# EAGLE design SubProgrammableBall (EAGLE 9.6.2)
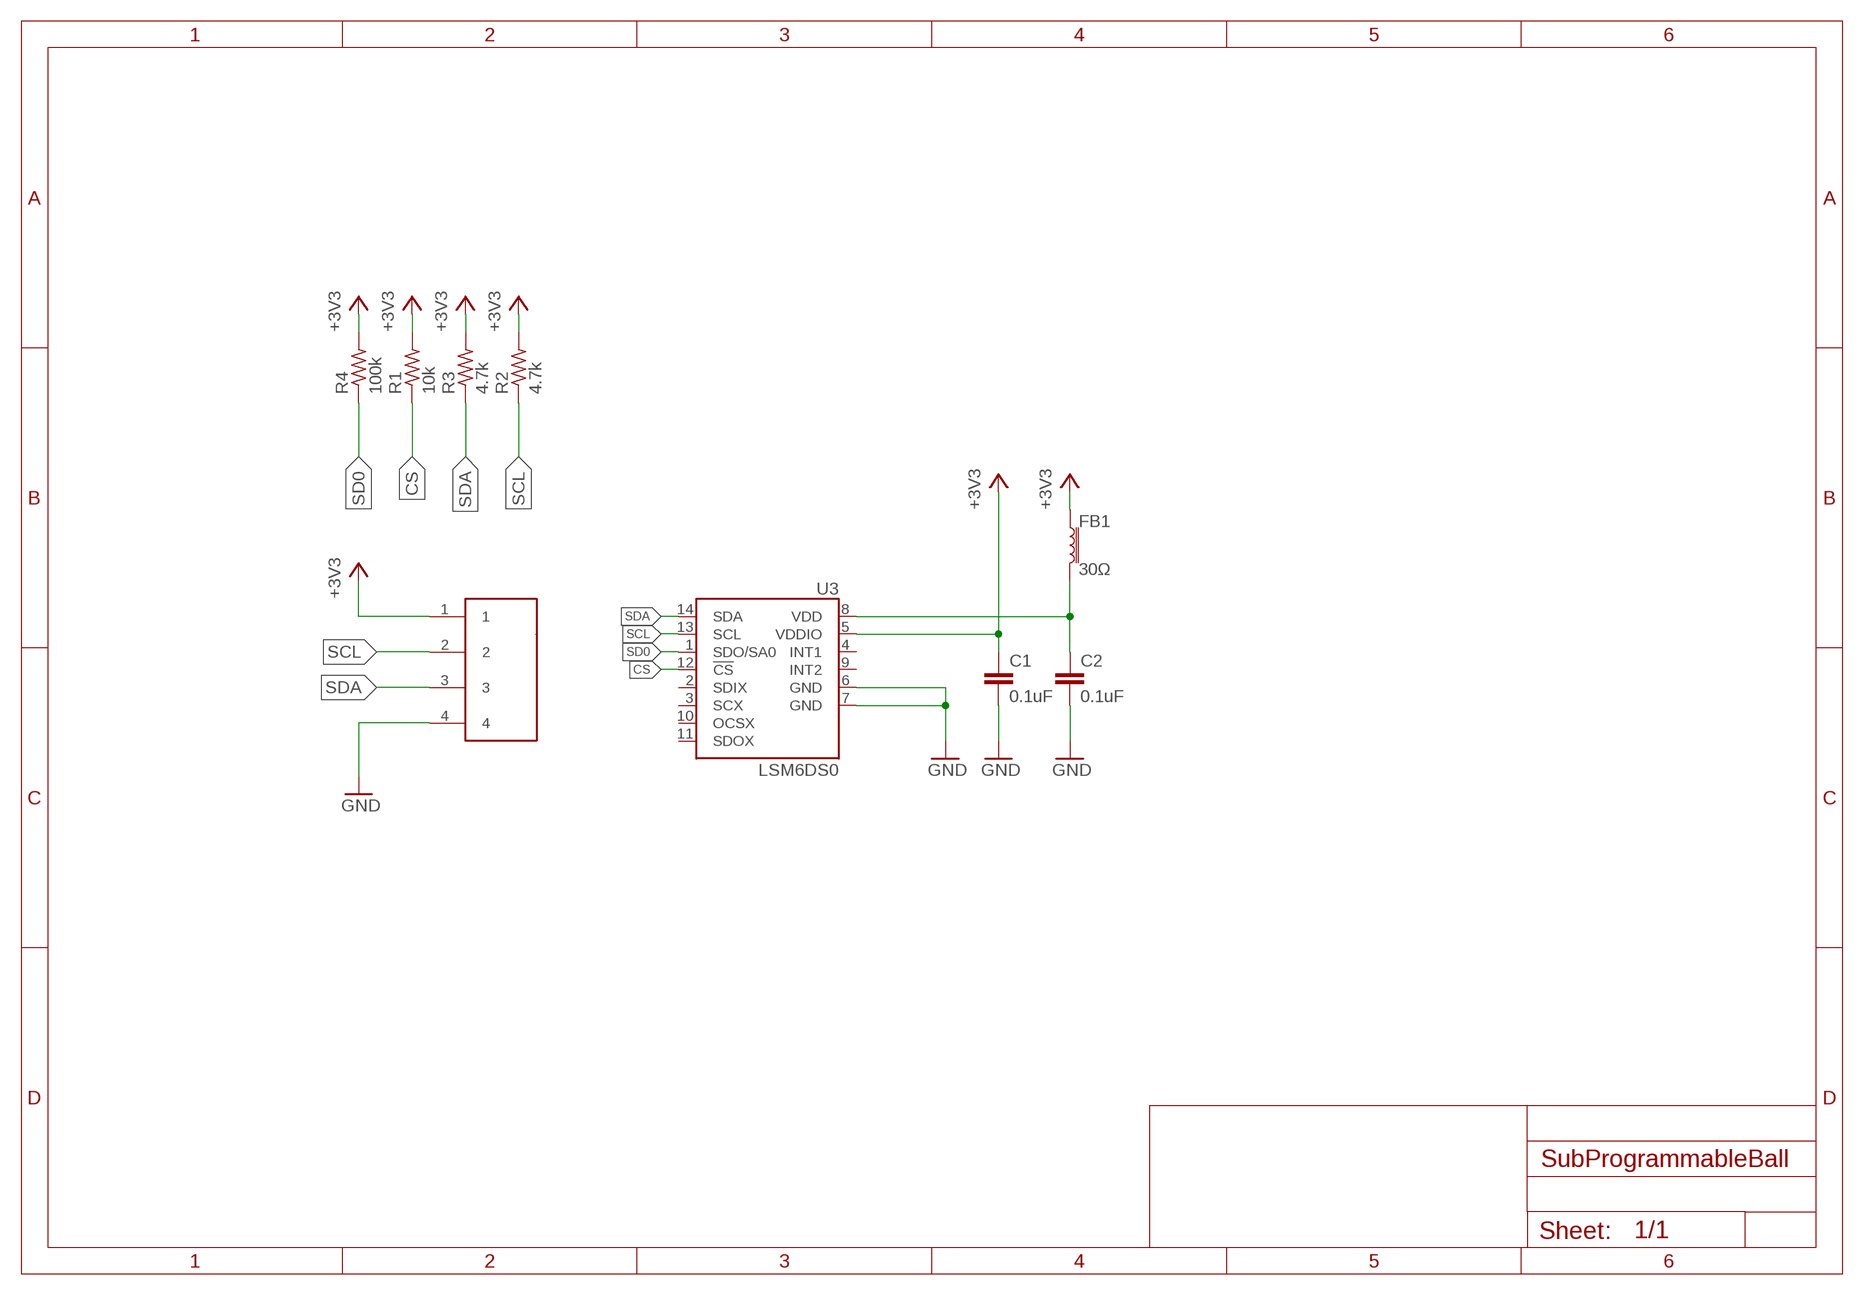
[diagram p0: schematic, sheet 1]

## Parts
C1  0.1uF  C-EUC0603  [C0603]
C2  0.1uF  C-EUC0603  [C0603]
CON1  B4B-ZR-SM4-TF  [CONN_B4B-ZR-SM4-TF]
FB1  30Ω  FERRITE_BEAD-0603-30Ω-100MHZ  [0603]
R1  10k  R-US_R0603  [R0603]
R2  4.7k  R-US_R0603  [R0603]
R3  4.7k  R-US_R0603  [R0603]
R4  100k  R-US_R0603  [R0603]
U3  LSM6DS0  [LGA14L]

## Nets
+3V3 [Power]: C1.1 CON1.1 FB1.1 R1.2 R2.2 R3.2 R4.2 U3.5(VDDIO)
CS: R1.1 U3.12(!CS!)
GND [GND]: C1.2 C2.2 CON1.4 U3.6(GND) U3.7(GND)
N$1: C2.1 FB1.2 U3.8(VDD)
SCL: CON1.2 R2.1 U3.13(SCL)
SD0: R4.1 U3.1(SDO/SA0)
SDA: CON1.3 R3.1 U3.14(SDA)
Unconnected: U3.2(SDIX) U3.3(SCX) U3.4(INT1) U3.9(INT2) U3.10(OCSX) U3.11(SDOX)

## Library data of the parts
C1 C2 = SubProgrammableBall:C-EU: CAPACITOR, European symbol; SPICEPREFIX: C
CON1 = SubProgrammableBall:B4B-ZR-SM4-TF
FB1 = SubProgrammableBall:FERRITE_BEAD: Ferrite Bead (blocks, cores, rings, chokes, etc.) Inductor with layers of ferrite used to suppress high frequencies. Often used to isolate high frequency noise. SparkFun Products: IOIO-OTG - V2.2 <https://www.sparkfun.com/products/13613> SparkFun SAMD21 Mini Breakout <https://www.sparkfun.com/products/13664> SparkFun 6 Degrees of Freedom Breakout - LSM6DS3 <https://www.sparkfun.com/products/13339> SparkFun SAMD21 Dev Breakout <https://www.sparkfun.com/products/13672> Lilypad MP3 <https://www.sparkfun.com/products/11013>; PROD_ID: NDUC-07859
R1-R4 = SubProgrammableBall:R-US_: RESISTOR, American symbol; SPICEPREFIX: R
U3 = temp:LSM6DS0; PROD_ID: IC-15837

## Net classes
1 Power: width 0.254 mm
2 GND: width 0.381 mm

## Board
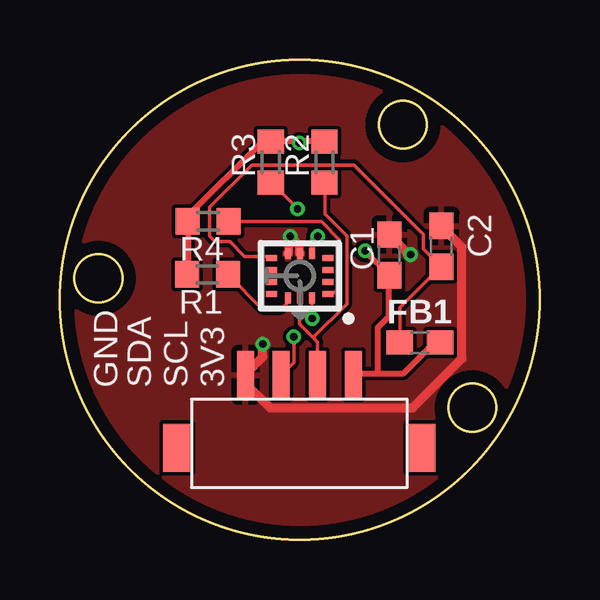
[diagram p1: board, top side]
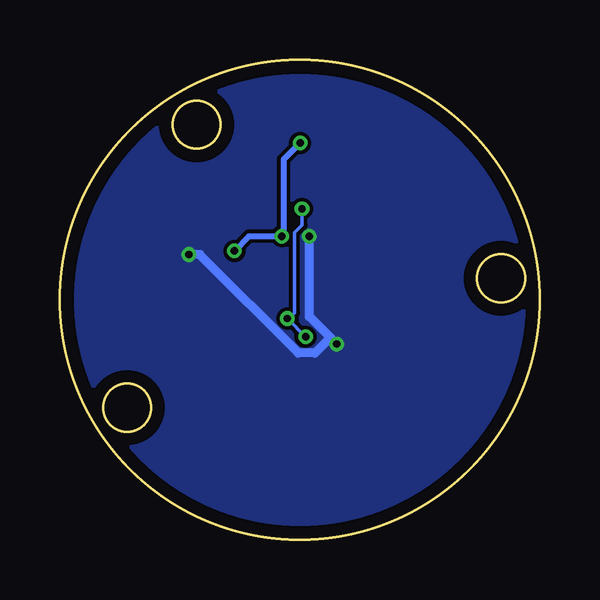
[diagram p2: board, bottom side, seen from below]

Size 20 x 20 mm. Coordinates in mm from the lower left corner, seen from the top.
Outline: circle at 10,10 radius 10
Outline: circle at 14.3,17.3 radius 1
Outline: circle at 17.2,5.5 radius 1
Outline: circle at 1.6,10.9 radius 1
Copper layers (1*16): Top 0.035mm / dielectric 1.6mm / Bottom 0.035mm
Design rules "Elecrow_2-layer_PCB_eagle_rule": minimum track width 6mil, minimum drill 12mil, track to track 6mil, track to pad 6mil, pad to pad 6mil, via to via 8mil, smd to smd 0mil, copper to edge 20mil, drill to drill 10mil, minimum pad ring 6mil, minimum via ring 6mil, stop-mask expansion 0mil, vias tented up to drill 100mil, thermal gap 10mil

### Footprints (pad centres in the part's own frame; a part is rotated, then mirrored left to right if it is on the bottom)
C0603 = smd 1.1 x 1: 1 -0.85,0; 2 0.85,0
CONN_B4B-ZR-SM4-TF = smd 0.711 x 1.981: 1 -2.261,-1.524; 2 -0.762,-1.524; 3 0.762,-1.524; 4 2.235,-1.524 | smd 1.194 x 2.007: 5 -5.08,1.524; 6 5.08,1.524
0603 = smd 1.1 x 1: 1 -0.85,0; 2 0.85,0
R0603 = smd 1 x 1.1: 1 -0.85,0; 2 0.85,0
LGA14L = smd 0.45 x 0.25: 1 -1.175,0.75; 2 -1.175,0.25; 3 -1.175,-0.25; 4 -1.175,-0.75; 8 1.175,-0.75; 9 1.175,-0.25; 10 1.175,0.25; 11 1.175,0.75 | smd 0.25 x 0.45: 5 -0.5,-0.925; 6 0,-0.925; 7 0.5,-0.925; 12 0.5,0.925; 13 0,0.925; 14 -0.5,0.925

### Placement (x,y rotation side)
C1  13.74,11.87 90 top
C2  15.91,12.23 90 top
CON1  9.98,5.34 180 top
FB1  15.01,8.22 180 top
R1  6.15,11.06 180 top
R2  11.03,15.74 90 top
R3  8.79,15.74 90 top
R4  6.18,13.27 180 top
U3  10,11 180 top

### Tracks (layer width: path | path; a pad name or v marks a point on that pad's centre or on a via)
+3V3  (via drill 0.3)
  Top 0.254: v10.74,12.65 10.52,12.42 10.52,11.96 U3.5 | v12.72,12.04 13.72,11.05 C1.1 13.72,10.9 13.72,9.3 13.26,8.84 13.26,6.93 | 13.26,6.93 12.27,6.93 CON1.1 | 13.26,6.93 14.33,6.93 15.54,8.15 15.85,8.15 FB1.1 | R1.2 5.33,11.12 R4.2 5.41,13.34 5.41,13.56 8.38,16.54 8.69,16.54 R3.2 8.84,16.61 9.98,16.61 | 9.98,16.61 10.97,16.61 R2.2 | v9.98,16.54 9.98,16.61
  Bottom 0.254: v12.72,12.04 12.12,12.65 v10.74,12.65 10.67,12.72 10.67,15.85 v9.98,16.54
CS
  Top 0.152: U3.12 9.45,10.06 9.45,9.83 9.22,9.6 8.46,9.6 7.01,11.05 R1.1
GND  (via drill 0.3)
  Top 0.381: 9.68,12.42 9.53,12.27 9.53,11.96 U3.7 | 9.68,12.42 9.83,12.42 9.98,12.27 9.98,11.96 U3.6 | v9.6,12.65 9.6,12.57 9.68,12.42 | v8.46,8.15 8.46,7.62 7.77,6.93 CON1.4 7.85,6.71 7.85,6.4 8.76,5.49 14.71,5.49 16.76,7.54 16.76,12.19 15.93,13.03 C2.2 | v14.63,11.89 14.55,11.89 13.79,12.65 C1.2
  Bottom 0.381: v9.6,12.65 9.6,9.3 8.72,8.42 | v8.46,8.15 8.72,8.42 | v14.63,11.89 14.17,11.89 10.06,7.77 9.37,7.77 8.72,8.42
  pour Top: 0,0 20,0 20,20 0,20
  pour Bottom: 0,20 20,20 20,0 0,0
N$1
  Top 0.152: U3.8 8.76,11.81 7.7,11.81 7.09,12.42 6.48,12.42 6.25,12.65 6.25,13.87 8,15.62 12.27,15.62 15.16,12.72 15.16,12.12 15.85,11.43 C2.1 15.85,11.35 14.17,9.68 14.17,8.23 FB1.2
SCL
  Top 0.152: 10.55,8.42 10.74,8.23 10.74,6.93 CON1.2 | 10.55,8.42 9.98,8.99 9.98,10.06 U3.13 | 10.55,8.42 11.96,9.83 11.96,12.65 11.05,13.56 11.05,14.86 R2.1
SD0
  Top 0.152: U3.1 11.2,10.29 11.43,10.29 11.66,10.52 11.66,12.5 10.9,13.26 7.09,13.26 R4.1
SDA  (via drill 0.3)
  Top 0.152: v10.52,9.22 10.52,10.06 U3.14 | v9.75,8.46 9.75,7.39 9.3,6.93 CON1.3 | v9.91,13.79 8.84,14.86 R3.1
  Bottom 0.152: v9.75,8.46 v10.52,9.22 10.44,9.22 10.21,9.45 10.21,12.8 9.91,13.11 v9.91,13.79

### Text on the board
tNames: GND | SDA | SCL | 3V3